# EasyEDA schematic home_auto.json
TITLE: Sheet_1; REV: 1.0; Date: 2019-09-17; Sheet: 1/1; Company: Your Company
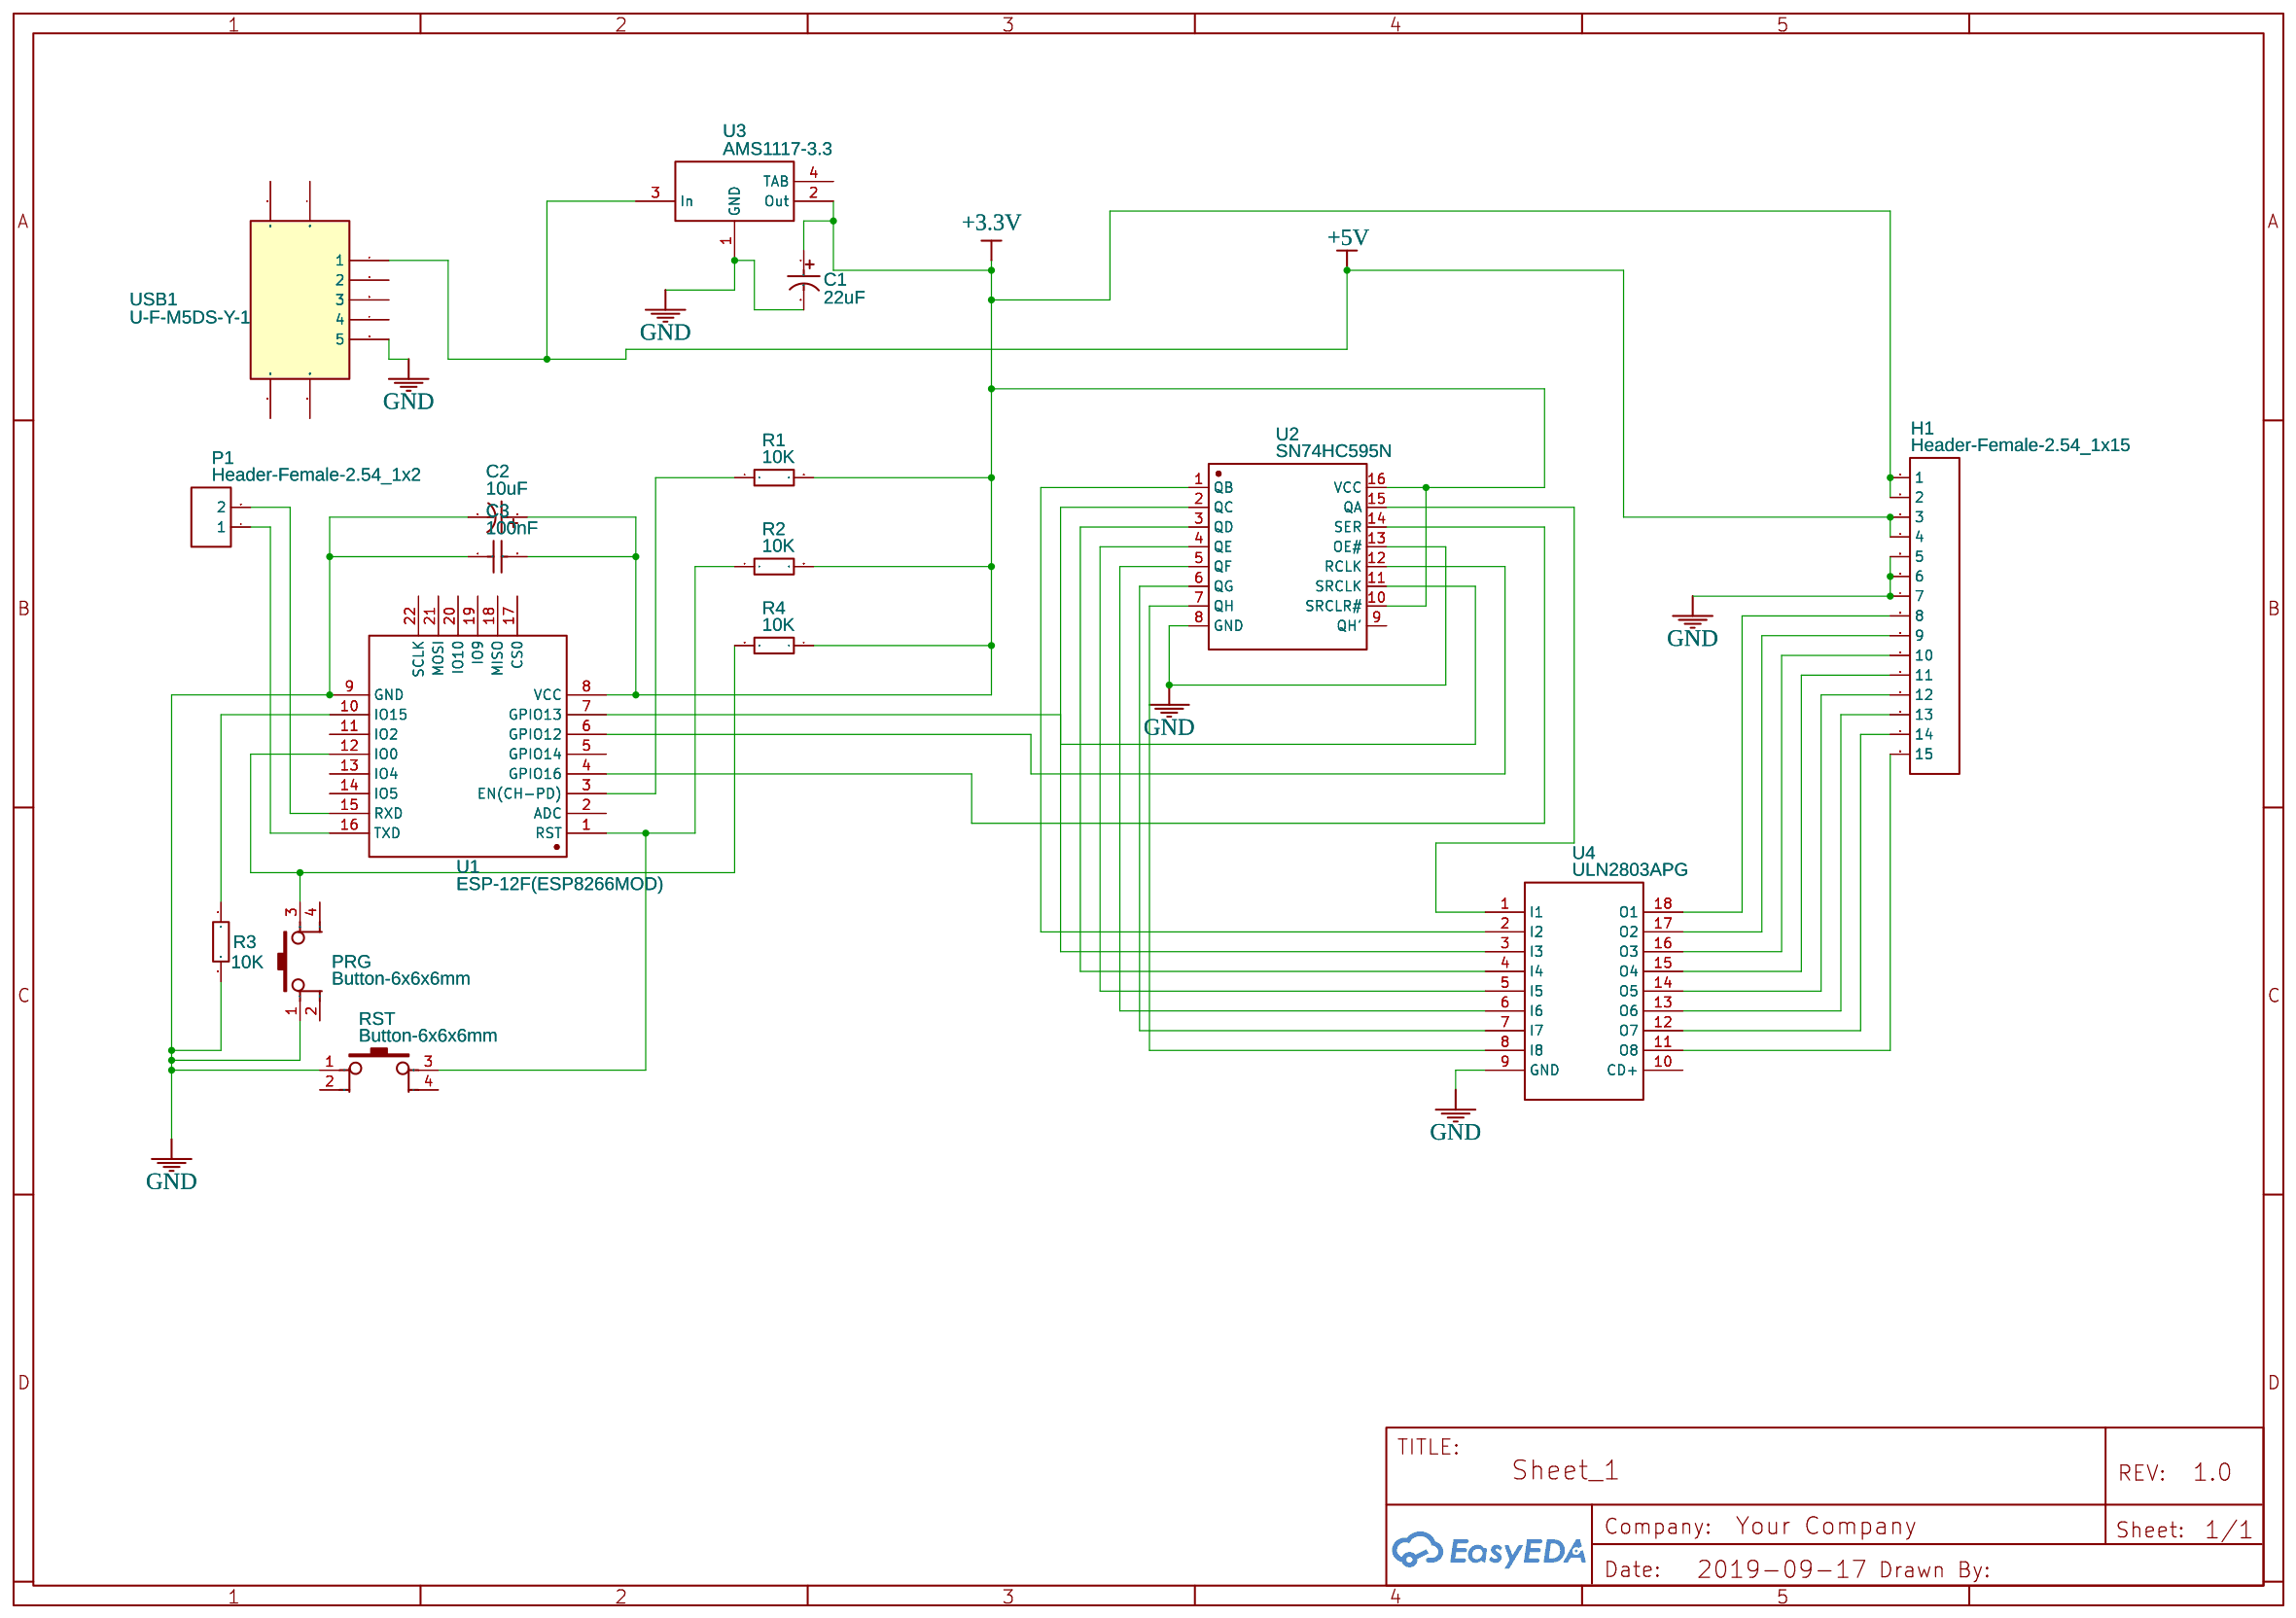
[diagram p0: schematic sheet]

## Parts
C1  22uF  [CAP-TH_BD5.0-P2.00-D0.8-L-FD]
C2  10uF  [CAP-TH_BD5.0-P2.00-D0.8-L-FD]
C3  100nF  [CAP-CBB-13.0*5.0]
H1  Header-Female-2.54_1x15  [DIP-1X15P2.54]
P1  Header-Female-2.54_1x2  [HDR-1X2/2.54]
PRG  Button-6x6x6mm  [SW-TH_4PIN-L6.00-W6.00]
R1  10K  [RES-9.0MMX3.3MM-RSF1WS]
R2  10K  [RES-9.0MMX3.3MM-RSF1WS]
R3  10K  [RES-9.0MMX3.3MM-RSF1WS]
R4  10K  [RES-9.0MMX3.3MM-RSF1WS]
RST  Button-6x6x6mm  [SW-TH_4PIN-L6.00-W6.00]
U1  ESP-12F(ESP8266MOD)  [WIFIM-SMD_ESP-12F-ESP8266MOD]
U2  SN74HC595N  [DIP-16]
U3  AMS1117-3.3  [SOT-223]
U4  ULN2803APG  [DIP-18]
USB1  U-F-M5DS-Y-1  [U-F-M5DS-Y-1]

## Library data of the parts
C1 = 22uF 16V 5*11: Supplier: LCSC; Manufacturer: ValuePro; Supplier Part: C43844
C2 = 10uF 16V 5*11: Supplier: LCSC; Manufacturer: ValuePro; Supplier Part: C43799
C3 = MPP104J4130510LC: Supplier: LCSC; Manufacturer: SRD; Supplier Part: C109501
H1 = -: Supplier: LCSC; Manufacturer: Ckmtw; Manufacturer Part: 220S-1*15P H=8.5MM Ytype Gold-plated; Supplier Part: C124408
P1 = -: Supplier: LCSC; Manufacturer: BOOMELE; Manufacturer Part: 2.54-1*2PFemale; image: //image.lceda.cn/szlcsc/C49661.jpg; Supplier Part: C49661
PRG RST = -: Supplier Part: C71836; Supplier: LCSC; Manufacturer: BBJ; Manufacturer Part: Switch,6*6*6Plastic head,260G, 0.25mm,Straight line
R1-R4 = MOR01SJ0103A10: Supplier: LCSC; Supplier Part: C64666; Manufacturer: Uniroyal Elec; Contributor: LCSC
U1 = -: Supplier: LCSC; Manufacturer: Ai-Thinker; Supplier Part: C82891
U2 = -: Supplier: LCSC; Manufacturer: TI; image: //image.lceda.cn/szlcsc/C78711.jpg; Supplier Part: C78711
U3 = -: sourceId: dwIGgezVh; Supplier: LCSC; Manufacturer: AMS; LCSC Assembly: Yes; image: //image.lceda.cn/szlcsc/C6186.jpg; Supplier Part: C6186; SMT Type: Basic
U4 = -: Supplier: LCSC; Manufacturer: TOSHIBA; image: //image.lceda.cn/szlcsc/C5252.jpg; Supplier Part: C5252
USB1 = -: Supplier: LCSC; Manufacturer: HRO; Supplier Part: C106818

## Nets
+3.3V: C1.1 C2.1 C3.2 H1.1 H1.2 R1.2 R2.2 R4.1 U1.8(VCC) U2.10(SRCLR#) U2.16(VCC) U3.2(Out)
+5V: H1.3 H1.4 U3.3(In) USB1.1
GND: C1.2 C2.2 C3.1 H1.5 H1.6 H1.7 PRG.1 R3.2 RST.1 U1.9(GND) U2.8(GND) U2.13(OE#) U3.1(GND) U4.9(GND) USB1.5
Net-(H1-8): H1.8 U4.18(O1)
Net-(H1-9): H1.9 U4.17(O2)
Net-(H1-10): H1.10 U4.16(O3)
Net-(H1-11): H1.11 U4.15(O4)
Net-(H1-12): H1.12 U4.14(O5)
Net-(H1-13): H1.13 U4.13(O6)
Net-(H1-14): H1.14 U4.12(O7)
Net-(H1-15): H1.15 U4.11(O8)
Net-(P1-1): P1.1 U1.16(TXD)
Net-(P1-2): P1.2 U1.15(RXD)
Net-(PRG-3): PRG.3 R4.2 U1.12(IO0)
Net-(R1-1): R1.1 U1.3(EN(CH-PD))
Net-(R2-1): R2.1 RST.3 U1.1(RST)
Net-(R3-1): R3.1 U1.10(IO15)
Net-(U1-4): U1.4(GPIO16) U2.14(SER)
Net-(U1-6): U1.6(GPIO12) U2.12(RCLK)
Net-(U1-7): U1.7(GPIO13) U2.11(SRCLK)
Net-(U2-1): U2.1(QB) U4.2(I2)
Net-(U2-2): U2.2(QC) U4.3(I3)
Net-(U2-3): U2.3(QD) U4.4(I4)
Net-(U2-4): U2.4(QE) U4.5(I5)
Net-(U2-5): U2.5(QF) U4.6(I6)
Net-(U2-6): U2.6(QG) U4.7(I7)
Net-(U2-7): U2.7(QH) U4.8(I8)
Net-(U2-15): U2.15(QA) U4.1(I1)

Not connected (* = marked no-connect by the designer): PRG 2 4; RST 2 4; U1 2(ADC) 5(GPIO14) 11(IO2) 13(IO4) 14(IO5) 17(CS0) 18(MISO) 19(IO9) 20(IO10) 21(MOSI) 22(SCLK); U2 9(QH'); U3 4(TAB); U4 10(CD+); USB1 0(MTN1) 2 3 4 6(MTN6) 7(MTN3)
